# EAGLE schematic SmartWatch (EAGLE 7.2.0)
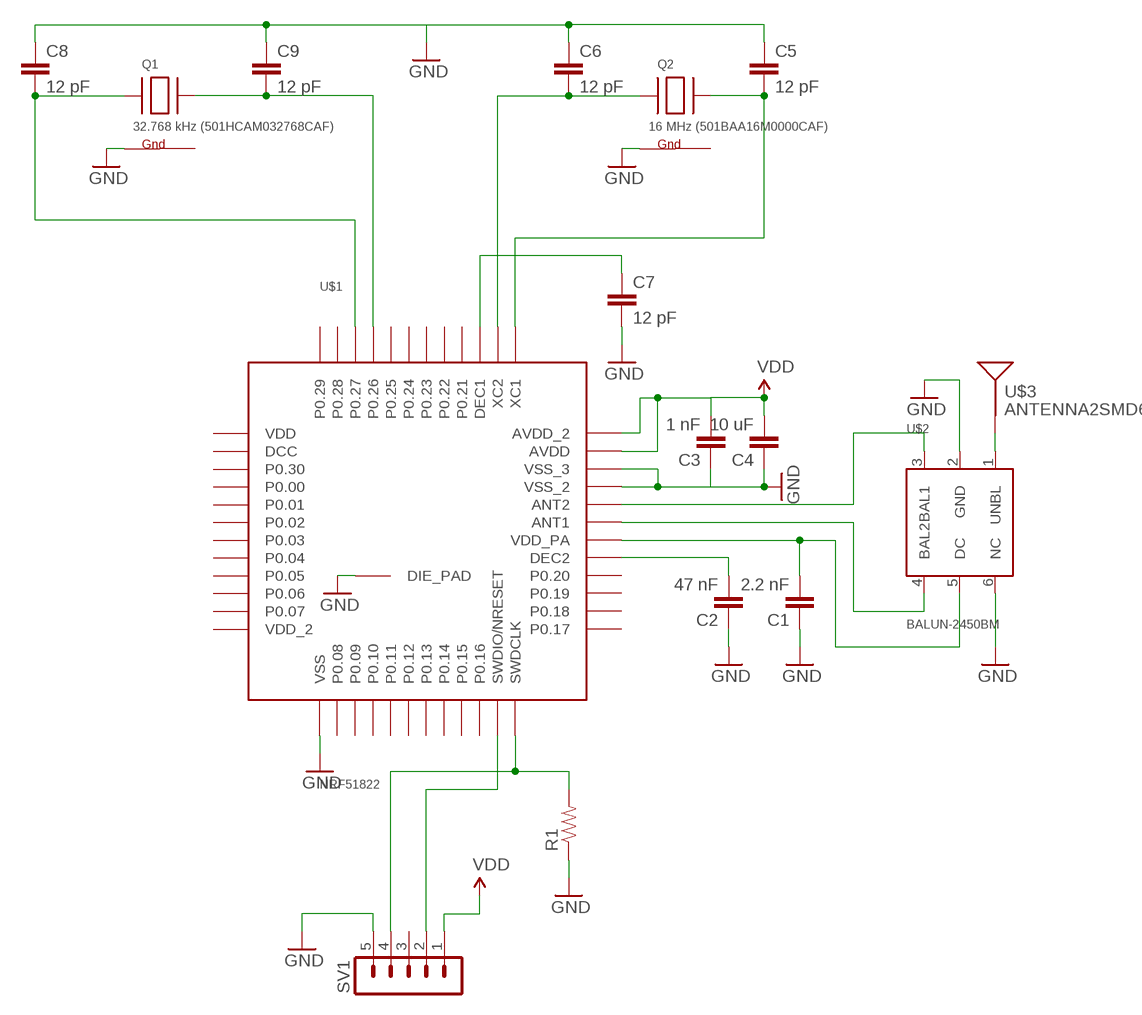
[diagram p0: schematic, sheet 1]

## Parts
C1  2.2 nF  CAP0603-CAP  [0603-CAP]
C2  47 nF  CAP0603-CAP  [0603-CAP]
C3  1 nF  CAP0603-CAP  [0603-CAP]
C4  10 uF  CAP0603-CAP  [0603-CAP]
C5  12 pF  CAP0603-CAP  [0603-CAP]
C6  12 pF  CAP0603-CAP  [0603-CAP]
C7  12 pF  CAP0603-CAP  [0603-CAP]
C8  12 pF  CAP0603-CAP  [0603-CAP]
C9  12 pF  CAP0603-CAP  [0603-CAP]
Q1  32.768 kHz (501HCAM032768CAF)  XTAL-4-3225  [NX3225]
Q2  16 MHz (501BAA16M0000CAF)  XTAL-4-3225  [NX3225]
R1  RESISTOR0603-RES  [0603-RES]
SV1  MA05-1  [MA05-1]
U$1  NRF51822  [QFN48]
U$2  BALUN-2450BM  [2450BM14A0002]
U$3  ANTENNA2SMD6  [ANTENNA-CHIP6]

## Nets
GND: C1.1 C2.1 C3.1 C4.1 C5.1 C6.1 C7.2 C8.1 C9.1 Q1.4(G1) Q2.4(G1) R1.1 SV1.5 U$1.13(VSS) U$1.33(VSS_2) U$1.34(VSS_3) U$1.GND(DIE_PAD) U$2.2(GND) U$2.6(NC)
N$1: U$1.32(ANT2) U$2.3(BAL1)
N$2: U$1.31(ANT1) U$2.4(BAL2)
N$3: C6.2 Q2.1(X1) U$1.38(XC2)
N$4: C2.2 U$1.29(DEC2)
N$5: C1.2 U$1.30(VDD_PA) U$2.5(DC)
N$6: C5.2 Q2.3(X2) U$1.37(XC1)
N$8: U$2.1(UNBL) U$3.1(SIGNAL)
N$9: R1.2 SV1.4 U$1.24(SWDCLK)
N$10: C7.1 U$1.39(DEC1)
N$12: C9.2 Q1.3(X2) U$1.45(P0.26)
N$13: C8.2 Q1.1(X1) U$1.46(P0.27)
N$16: SV1.2 U$1.23(SWDIO/NRESET)
VDD: C3.2 C4.2 SV1.1 U$1.35(AVDD) U$1.36(AVDD_2)
Unconnected: SV1.3 U$1.1(VDD) U$1.2(DCC) U$1.3(P0.30) U$1.4(P0.00) U$1.5(P0.01) U$1.6(P0.02) U$1.7(P0.03) U$1.8(P0.04) U$1.9(P0.05) U$1.10(P0.06) U$1.11(P0.07) U$1.12(VDD_2) U$1.14(P0.08) U$1.15(P0.09) U$1.16(P0.10) U$1.17(P0.11) U$1.18(P0.12) U$1.19(P0.13) U$1.20(P0.14) U$1.21(P0.15) U$1.22(P0.16) U$1.25(P0.17) U$1.26(P0.18) U$1.27(P0.19) U$1.28(P0.20) U$1.40(P0.21) U$1.41(P0.22) U$1.42(P0.23) U$1.43(P0.24) U$1.44(P0.25) U$1.47(P0.28) U$1.48(P0.29)

## Power pins joined to a net without a drawn wire
G2: Q1.2(G2) Q2.2(G2)

## Library data of the parts
C1-C9 = SparkFun-Capacitors:CAP: Capacitor Standard 0603 ceramic capacitor, and 0.1" leaded capacitor.
Q1 Q2 = adafruit:XTAL-4: Classic 4-pin 3.2 x 2.5mm crystal
R1 = SparkFun-Resistors:RESISTOR: Resistor Basic schematic elements and footprints for 0603, 1206, and PTH resistors.
SV1 = con-lstb:MA05-1: PIN HEADER; OC_FARNELL: unknown; OC_NEWARK: unknown
U$1 = NordicSemi:NRF51822: Bluetooth 4.0 Low Energy/2.4Ghz NORDIC SEMICONDUCTOR
U$2 = NordicSemi:BALUN-2450BM: General Specifications: Part Number 2450BM14A0002 Insertion Loss 2.0 dB max. Frequency (MHz) 2400 - 2500 Return Loss 9.5 dB min. Unbalanced Impedance 50 Ω Phase Difference 160° ± 15° Amplitude Difference 3.5 ± 1.5 dB Reel Quanity 4,000 Operating Temperature -40 to +85°C Attenuation: Common Mode 2.45 GHz Impedance Matched Balun-Filter: Optimized for Nordic's Chipset nRF24L01/+ Differential Balanced Impedance Conjugate match to Nordic nRF24L01/nRF24L01+ Attenuation: Differential Mode 15 min.@4800~5000MHz 15 min.@7200~7500MHz
U$3 = SparkFun-RF:ANTENNA2: Chip antenna Single endded antenna. Common with smaller chip antennas. CHIP4 package is the GPS Chip Antenna SKU: GPS-08418. CHIP5 package is 2.4GHz chip antenna SKU: WRL-00144.